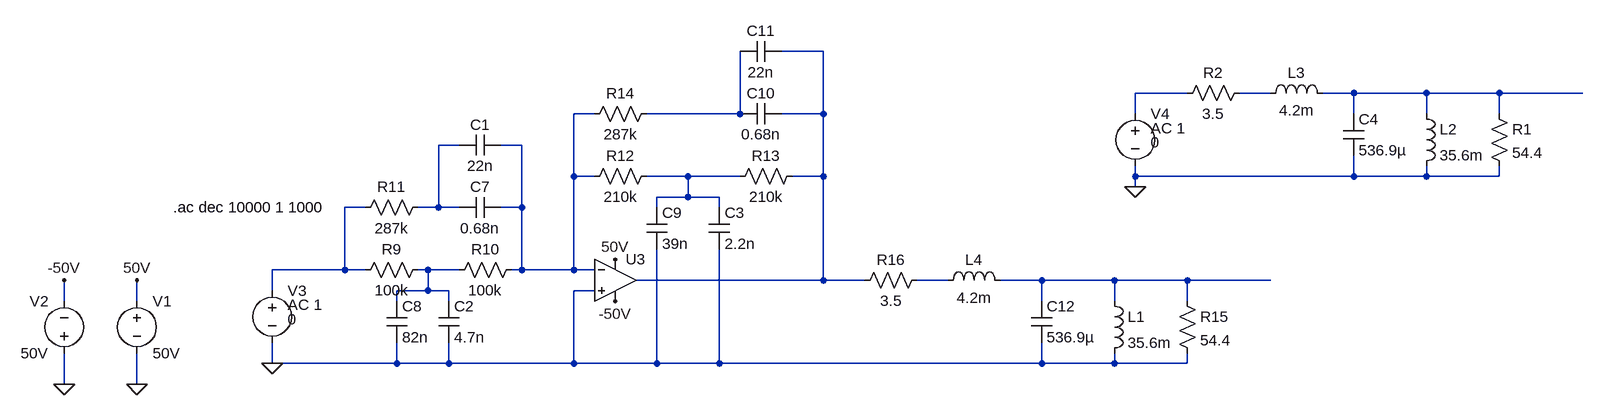
[diagram p0: schematic lt_thor.asc]
lt_thor.asc, the LTspice schematic file:
Version 4
SHEET 1 880 788
WIRE -576 224 -640 224
WIRE -16 288 -96 288
WIRE 112 288 64 288
WIRE 240 288 192 288
WIRE 352 288 240 288
WIRE 464 288 352 288
WIRE 592 288 464 288
WIRE -928 320 -960 320
WIRE -704 320 -704 224
WIRE -704 320 -848 320
WIRE -576 320 -576 224
WIRE -576 320 -640 320
WIRE -96 320 -96 288
WIRE 240 320 240 288
WIRE 352 320 352 288
WIRE 464 320 464 288
WIRE -1136 368 -1168 368
WIRE -1040 368 -1072 368
WIRE -960 416 -960 320
WIRE -928 416 -960 416
WIRE -784 416 -848 416
WIRE -704 416 -784 416
WIRE -576 416 -576 320
WIRE -576 416 -624 416
WIRE -96 416 -96 400
WIRE 240 416 240 384
WIRE 240 416 -96 416
WIRE 352 416 352 400
WIRE 352 416 240 416
WIRE 464 416 464 400
WIRE 464 416 352 416
WIRE -96 432 -96 416
WIRE -784 448 -784 416
WIRE -784 448 -832 448
WIRE -736 448 -784 448
WIRE -1280 464 -1312 464
WIRE -1168 464 -1168 368
WIRE -1168 464 -1200 464
WIRE -1136 464 -1168 464
WIRE -1040 464 -1040 368
WIRE -1040 464 -1072 464
WIRE -832 464 -832 448
WIRE -736 464 -736 448
WIRE -1312 560 -1312 464
WIRE -1312 560 -1424 560
WIRE -1280 560 -1312 560
WIRE -1184 560 -1200 560
WIRE -1136 560 -1184 560
WIRE -1040 560 -1040 464
WIRE -1040 560 -1056 560
WIRE -960 560 -960 416
WIRE -960 560 -1040 560
WIRE -928 560 -960 560
WIRE -576 576 -576 416
WIRE -576 576 -864 576
WIRE -512 576 -576 576
WIRE -384 576 -432 576
WIRE -240 576 -304 576
WIRE -128 576 -240 576
WIRE -16 576 -128 576
WIRE 112 576 -16 576
WIRE -1424 592 -1424 560
WIRE -1184 592 -1184 560
WIRE -1184 592 -1232 592
WIRE -1152 592 -1184 592
WIRE -928 592 -960 592
WIRE -1744 608 -1744 576
WIRE -1632 608 -1632 576
WIRE -1232 608 -1232 592
WIRE -1152 608 -1152 592
WIRE -240 608 -240 576
WIRE -128 608 -128 576
WIRE -16 608 -16 576
WIRE -1424 704 -1424 672
WIRE -1232 704 -1232 672
WIRE -1232 704 -1424 704
WIRE -1152 704 -1152 672
WIRE -1152 704 -1232 704
WIRE -960 704 -960 592
WIRE -960 704 -1152 704
WIRE -832 704 -832 528
WIRE -832 704 -960 704
WIRE -736 704 -736 528
WIRE -736 704 -832 704
WIRE -240 704 -240 672
WIRE -240 704 -736 704
WIRE -128 704 -128 688
WIRE -128 704 -240 704
WIRE -16 704 -16 688
WIRE -16 704 -128 704
WIRE -1744 736 -1744 688
WIRE -1632 736 -1632 688
FLAG -1424 704 0
FLAG -1632 576 50V
FLAG -1744 576 -50V
FLAG -1744 736 0
FLAG -1632 736 0
FLAG -896 544 50V
FLAG -896 608 -50V
FLAG -96 432 0
SYMBOL res -1184 544 R90
WINDOW 0 0 56 VBottom 2
WINDOW 3 32 56 VTop 2
SYMATTR InstName R9
SYMATTR Value 100k
SYMBOL res -1040 544 R90
WINDOW 0 0 56 VBottom 2
WINDOW 3 32 56 VTop 2
SYMATTR InstName R10
SYMATTR Value 100k
SYMBOL res -1184 448 R90
WINDOW 0 0 56 VBottom 2
WINDOW 3 32 56 VTop 2
SYMATTR InstName R11
SYMATTR Value 287k
SYMBOL cap -1072 448 R90
WINDOW 0 0 32 VBottom 2
WINDOW 3 32 32 VTop 2
SYMATTR InstName C7
SYMATTR Value 0.68n
SYMBOL Opamps/UniversalOpamp2 -896 576 R0
SYMATTR InstName U3
SYMBOL cap -1248 608 R0
SYMATTR InstName C8
SYMATTR Value 82n
SYMBOL res -832 400 R90
WINDOW 0 0 56 VBottom 2
WINDOW 3 32 56 VTop 2
SYMATTR InstName R12
SYMATTR Value 210k
SYMBOL cap -848 464 R0
SYMATTR InstName C9
SYMATTR Value 39n
SYMBOL res -608 400 R90
WINDOW 0 0 56 VBottom 2
WINDOW 3 32 56 VTop 2
SYMATTR InstName R13
SYMATTR Value 210k
SYMBOL res -832 304 R90
WINDOW 0 0 56 VBottom 2
WINDOW 3 32 56 VTop 2
SYMATTR InstName R14
SYMATTR Value 287k
SYMBOL cap -640 304 R90
WINDOW 0 0 32 VBottom 2
WINDOW 3 32 32 VTop 2
SYMATTR InstName C10
SYMATTR Value 0.68n
SYMBOL cap -640 208 R90
WINDOW 0 0 32 VBottom 2
WINDOW 3 32 32 VTop 2
SYMATTR InstName C11
SYMATTR Value 22n
SYMBOL cap -256 608 R0
SYMATTR InstName C12
SYMATTR Value 536.9µ
SYMBOL ind -144 592 R0
SYMATTR InstName L1
SYMATTR Value 35.6m
SYMBOL res -32 592 R0
SYMATTR InstName R15
SYMATTR Value 54.4
SYMBOL res -416 560 R90
WINDOW 0 0 56 VBottom 2
WINDOW 3 32 56 VTop 2
SYMATTR InstName R16
SYMATTR Value 3.5
SYMBOL voltage -1424 576 R0
WINDOW 123 24 38 Left 2
WINDOW 39 0 0 Left 0
WINDOW 3 24 60 Left 2
SYMATTR Value2 AC 1
SYMATTR Value 0
SYMATTR InstName V3
SYMBOL voltage -1632 592 R0
SYMATTR InstName V1
SYMATTR Value 50V
SYMBOL voltage -1744 704 R180
WINDOW 0 24 96 Left 2
WINDOW 3 24 16 Left 2
SYMATTR InstName V2
SYMATTR Value 50V
SYMBOL cap -1072 352 R90
WINDOW 0 0 32 VBottom 2
WINDOW 3 32 32 VTop 2
SYMATTR InstName C1
SYMATTR Value 22n
SYMBOL cap -1168 608 R0
SYMATTR InstName C2
SYMATTR Value 4.7n
SYMBOL cap -752 464 R0
SYMATTR InstName C3
SYMATTR Value 2.2n
SYMBOL cap 224 320 R0
SYMATTR InstName C4
SYMATTR Value 536.9µ
SYMBOL ind 336 304 R0
SYMATTR InstName L2
SYMATTR Value 35.6m
SYMBOL res 448 304 R0
SYMATTR InstName R1
SYMATTR Value 54.4
SYMBOL res 80 272 R90
WINDOW 0 0 56 VBottom 2
WINDOW 3 32 56 VTop 2
SYMATTR InstName R2
SYMATTR Value 3.5
SYMBOL voltage -96 304 R0
WINDOW 123 24 38 Left 2
WINDOW 39 0 0 Left 0
WINDOW 3 24 60 Left 2
SYMATTR Value2 AC 1
SYMATTR Value 0
SYMATTR InstName V4
SYMBOL ind 96 304 R270
WINDOW 0 32 56 VTop 2
WINDOW 3 5 56 VBottom 2
SYMATTR InstName L3
SYMATTR Value 4.2m
SYMBOL ind -288 592 M270
WINDOW 0 32 56 VTop 2
WINDOW 3 5 56 VBottom 2
SYMATTR InstName L4
SYMATTR Value 4.2m
TEXT -1576 464 Left 2 !.ac dec 10000 1 1000

The netlist it stands for:
* lt_thor.asc
R9 N010 N009 100k
R10 N005 N010 100k
R11 N007 N009 287k
C7 N005 N007 0.68n
XU3 0 N005 50V -50V N001 level.2 Avol=1Meg GBW=10Meg Slew=10Meg ilimit=25m rail=0 Vos=0 phimargin=45 en=0 enk=0 in=0 ink=0 Rin=500Meg  ; pins IN+ IN- V+ V- OUT
C8 N010 0 82n
R12 N008 N005 210k
C9 N008 0 39n
R13 N001 N008 210k
R14 N006 N005 287k
C10 N001 N006 0.68n
C11 N001 N006 22n
C12 N012 0 536.9µ
L1 N012 0 35.6m
R15 N012 0 54.4
R16 N011 N001 3.5
V3 N009 0 0 AC 1
V1 50V 0 50V
V2 0 -50V 50V
C1 N005 N007 22n
C2 N010 0 4.7n
C3 N008 0 2.2n
C4 N004 0 536.9µ
L2 N004 0 35.6m
R1 N004 0 54.4
R2 N003 N002 3.5
V4 N002 0 0 AC 1
L3 N003 N004 4.2m
L4 N012 N011 4.2m
.ac dec 10000 1 1000
.lib UniversalOpamps2.sub
.backanno
.end